# EAGLE design pdb12 (EAGLE 9.5.1)
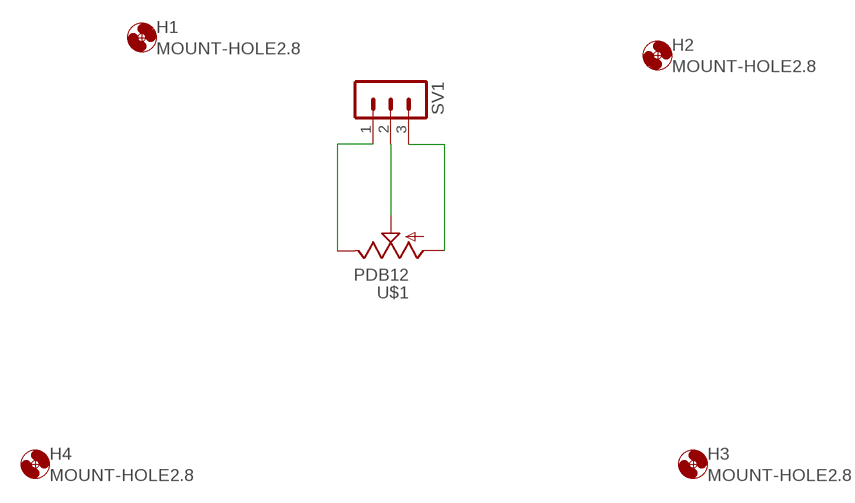
[diagram p0: schematic, sheet 1]

## Parts
H1  MOUNT-HOLE2.8  [2,8]
H2  MOUNT-HOLE2.8  [2,8]
H3  MOUNT-HOLE2.8  [2,8]
H4  MOUNT-HOLE2.8  [2,8]
SV1  MA03-1  [MA03-1]
U$1  PDB12  [PDB12]

## Nets
N$1: SV1.1 U$1.P$3(E)
N$2: SV1.2 U$1.P$1(S)
N$3: SV1.3 U$1.P$2(A)

## Library data of the parts
H1-H4 = holes:MOUNT-HOLE: MOUNTING HOLE with drill center marker
SV1 = con-lstb:MA03-1: PIN HEADER; OC_FARNELL: unknown; OC_NEWARK: unknown
U$1 = pdb12:PDB12

## Board
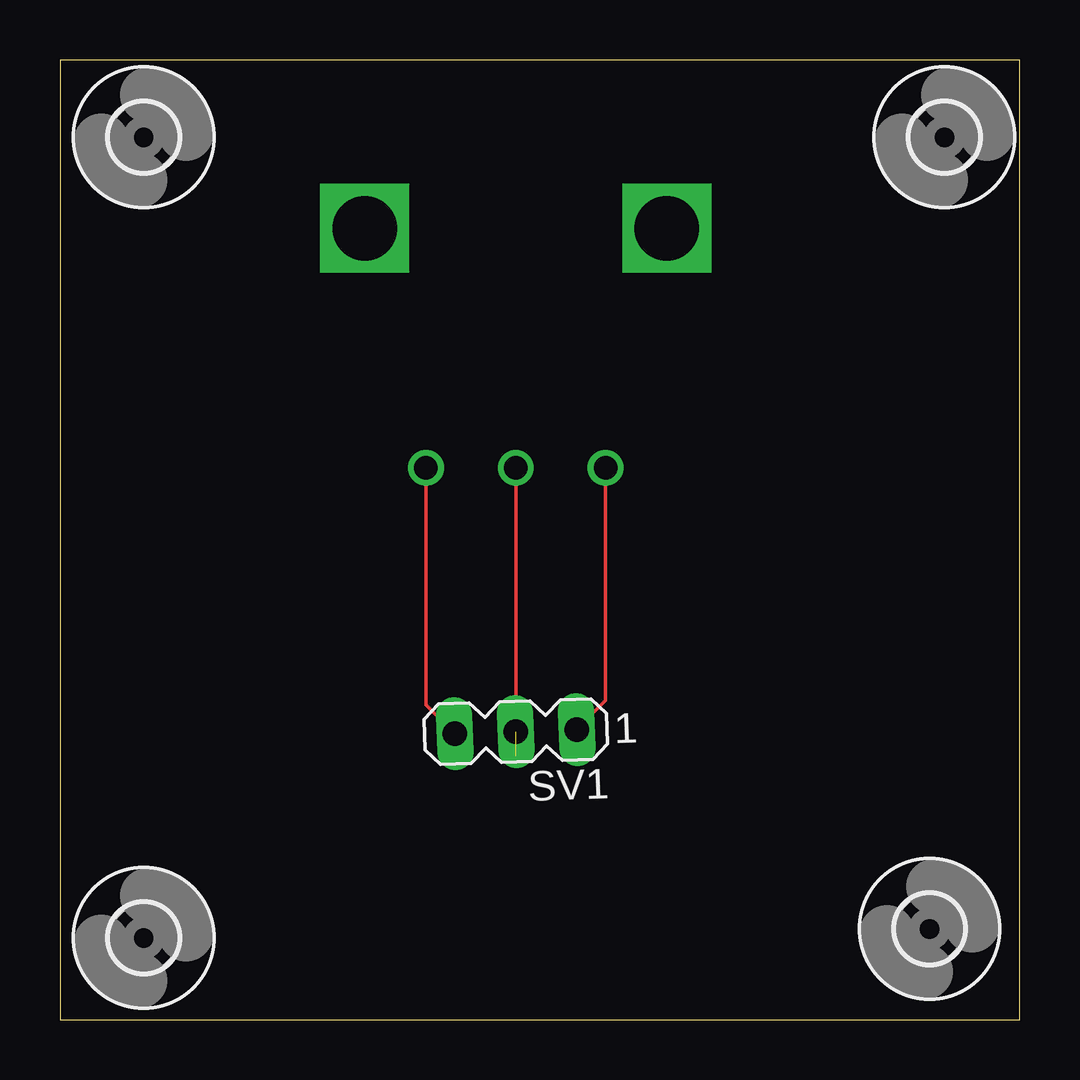
[diagram p1: board, top side]

Size 40 x 40 mm. Coordinates in mm from the lower left corner, seen from the top.
Outline: 0,0 40,0 40,40 0,40 0,0
Copper layers (1*16): Top 0.035mm / dielectric 1.5mm / Bottom 0.035mm
Design rules "default": minimum track width 6mil, minimum drill 0.35mm, track to track 6mil, track to pad 6mil, pad to pad 6mil, via to via 6mil, smd to smd 6mil, copper to edge 40mil, drill to drill 6mil, minimum pad ring 10mil, minimum via ring 8mil, stop-mask expansion 4mil, vias tented up to drill 0mil, thermal gap 10mil

### Footprints (pad centres in the part's own frame; a part is rotated, then mirrored left to right if it is on the bottom)
2,8 = hole 2.8: 0,0
MA03-1 = drill 1.016 long: 1 -2.54,0; 2 0,0; 3 2.54,0
PDB12 = drill 0.991: P$1 0,0; P$2 -3.747,0; P$3 3.747,0 | drill 2.692 square: P$4 -6.299,9.982; P$5 6.299,9.982

### Placement (x,y rotation side)
H1  3.49,36.78 0 top
H2  36.87,36.78 0 top
H3  36.25,3.78 0 top
H4  3.49,3.4 0 top
SV1  19,12 181.9 top
U$1  19,23 0 top

### Tracks (layer width: path | path; a pad name or v marks a point on that pad's centre or on a via)
N$1
  Top 0.152: U$1.P$3 22.75,13.29 SV1.1
N$2  (1 unrouted)
  Top 0.152: U$1.P$1 19,11
N$3
  Top 0.152: U$1.P$2 15.25,13.12 SV1.3